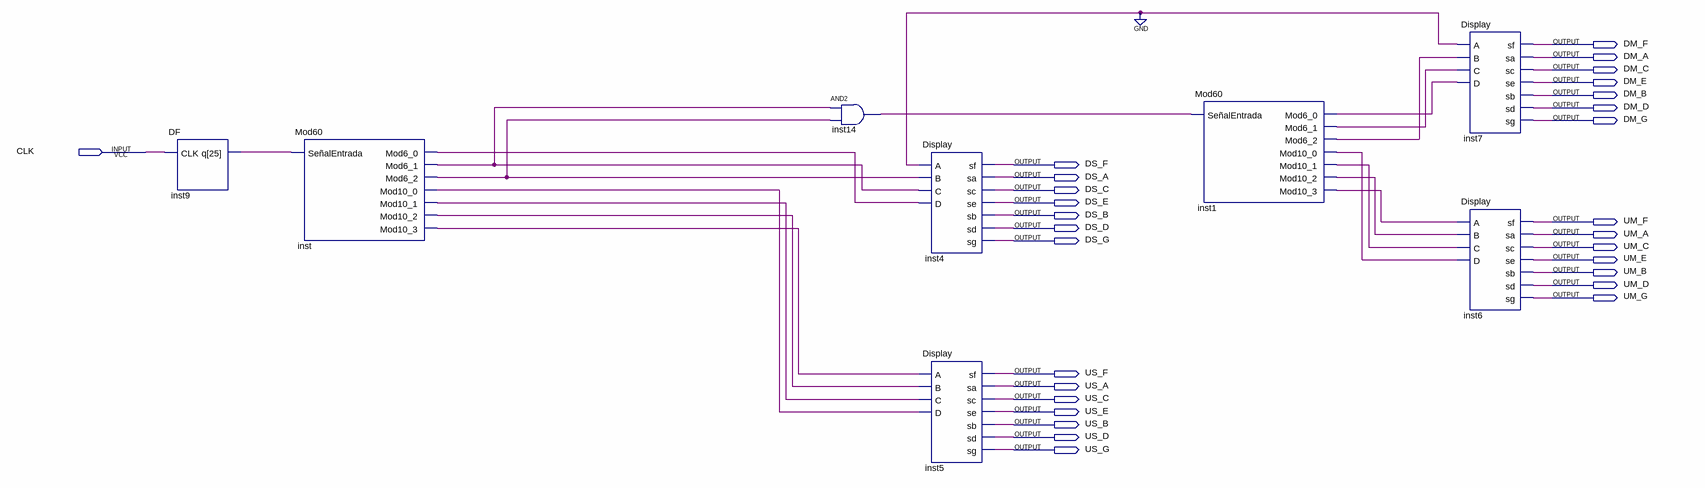
[diagram p0: schematic sheet]
// Quartus schematic Relojito4.bdf as structural Verilog: 8 symbols, 29 pins
module Relojito4 (
  input  CLK,
  output DM_F,
  output DM_A,
  output DM_C,
  output DM_E,
  output DM_B,
  output DM_D,
  output DM_G,
  output DS_F,
  output DS_A,
  output DS_C,
  output DS_E,
  output DS_B,
  output UM_F,
  output DS_D,
  output UM_A,
  output DS_G,
  output UM_C,
  output UM_E,
  output UM_B,
  output UM_D,
  output UM_G,
  output US_F,
  output US_A,
  output US_C,
  output US_E,
  output US_B,
  output US_D,
  output US_G
);

  wire inst1_mod6_0, inst1_mod6_1, inst1_mod6_2, inst1_mod10_0, inst1_mod10_1, inst1_mod10_2, inst1_mod10_3,
       inst9_q, inst14_out, inst_mod6_0, inst_mod6_1, inst_mod6_2, inst_mod10_0, inst_mod10_1, inst_mod10_2,
       inst_mod10_3;

  DF inst9 (.CLK(CLK), .q(inst9_q));
  Mod60 inst (
    .\SeñalEntrada (inst9_q), .Mod6_0(inst_mod6_0), .Mod6_1(inst_mod6_1), .Mod6_2(inst_mod6_2),
    .Mod10_0(inst_mod10_0), .Mod10_1(inst_mod10_1), .Mod10_2(inst_mod10_2), .Mod10_3(inst_mod10_3));
  and inst14 (inst14_out, inst_mod6_1, inst_mod6_2);
  Display inst4 (
    .A(1'b0), .B(inst_mod6_2), .C(inst_mod6_1), .D(inst_mod6_0), .sf(DS_F), .sa(DS_A), .sc(DS_C), .se(DS_E),
    .sb(DS_B), .sd(DS_D), .sg(DS_G));
  Display inst5 (
    .A(inst_mod10_3), .B(inst_mod10_2), .C(inst_mod10_1), .D(inst_mod10_0), .sf(US_F), .sa(US_A), .sc(US_C),
    .se(US_E), .sb(US_B), .sd(US_D), .sg(US_G));
  Mod60 inst1 (
    .\SeñalEntrada (inst14_out), .Mod6_0(inst1_mod6_0), .Mod6_1(inst1_mod6_1), .Mod6_2(inst1_mod6_2),
    .Mod10_0(inst1_mod10_0), .Mod10_1(inst1_mod10_1), .Mod10_2(inst1_mod10_2), .Mod10_3(inst1_mod10_3));
  Display inst7 (
    .A(1'b0), .B(inst1_mod6_2), .C(inst1_mod6_1), .D(inst1_mod6_0), .sf(DM_F), .sa(DM_A), .sc(DM_C),
    .se(DM_E), .sb(DM_B), .sd(DM_D), .sg(DM_G));
  Display inst6 (
    .A(inst1_mod10_3), .B(inst1_mod10_2), .C(inst1_mod10_1), .D(inst1_mod10_0), .sf(UM_F), .sa(UM_A),
    .sc(UM_C), .se(UM_E), .sb(UM_B), .sd(UM_D), .sg(UM_G));
endmodule
